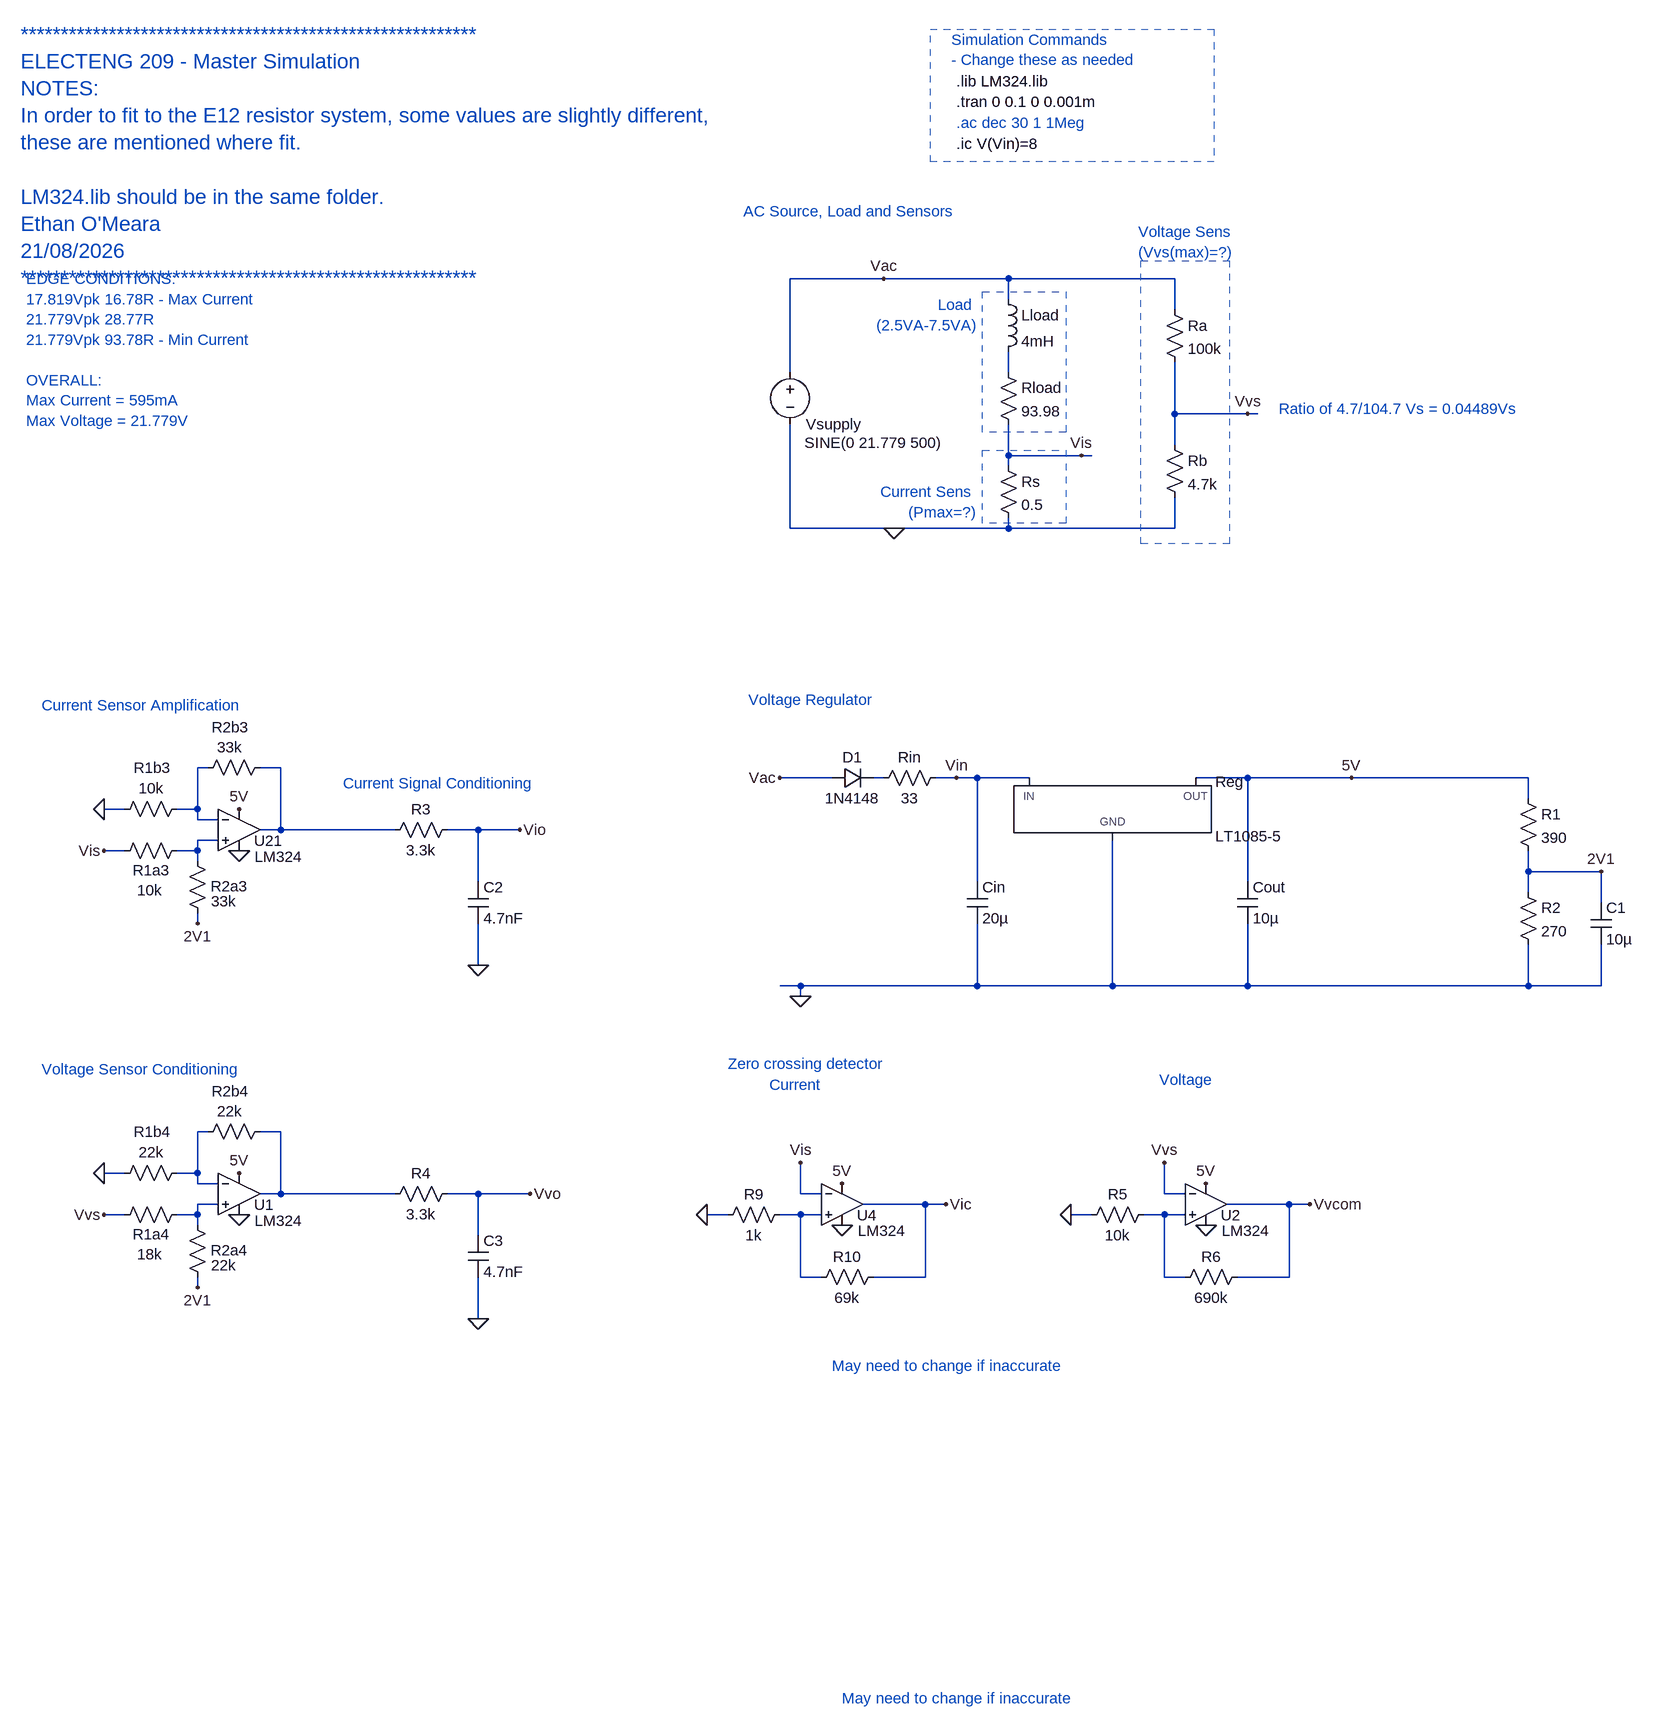
[diagram p0: schematic Master Simulation.asc]
Master Simulation.asc, the LTspice schematic file:
Version 4.1
SHEET 1 1984 2980
WIRE 544 160 400 160
WIRE 736 160 544 160
WIRE 992 160 736 160
WIRE 736 192 736 160
WIRE 992 208 992 160
WIRE 400 304 400 160
WIRE 736 304 736 272
WIRE 992 368 992 288
WIRE 1104 368 992 368
WIRE 1120 368 1104 368
WIRE 992 416 992 368
WIRE 736 432 736 384
WIRE 848 432 736 432
WIRE 864 432 848 432
WIRE 736 448 736 432
WIRE 400 544 400 384
WIRE 560 544 400 544
WIRE 736 544 736 528
WIRE 736 544 560 544
WIRE 992 544 992 496
WIRE 992 544 736 544
WIRE -496 912 -512 912
WIRE -384 912 -416 912
WIRE 464 928 384 928
WIRE 544 928 528 928
WIRE 656 928 624 928
WIRE 688 928 656 928
WIRE 768 928 688 928
WIRE 1104 928 1024 928
WIRE 1264 928 1104 928
WIRE 1536 928 1264 928
WIRE 1536 960 1536 928
WIRE -624 976 -656 976
WIRE -512 976 -512 912
WIRE -512 976 -544 976
WIRE -512 992 -512 976
WIRE -480 992 -512 992
WIRE -384 1008 -384 912
WIRE -384 1008 -416 1008
WIRE -208 1008 -384 1008
WIRE -80 1008 -128 1008
WIRE -16 1008 -80 1008
WIRE -480 1024 -512 1024
WIRE -624 1040 -656 1040
WIRE -512 1040 -512 1024
WIRE -512 1040 -544 1040
WIRE -512 1056 -512 1040
WIRE 1536 1072 1536 1040
WIRE 1648 1072 1536 1072
WIRE -80 1088 -80 1008
WIRE 688 1088 688 928
WIRE 1104 1088 1104 928
WIRE 1536 1104 1536 1072
WIRE 1648 1120 1648 1072
WIRE -512 1152 -512 1136
WIRE -80 1216 -80 1152
WIRE 416 1248 384 1248
WIRE 688 1248 688 1152
WIRE 688 1248 416 1248
WIRE 896 1248 896 1024
WIRE 896 1248 688 1248
WIRE 1104 1248 1104 1152
WIRE 1104 1248 896 1248
WIRE 1536 1248 1536 1184
WIRE 1536 1248 1104 1248
WIRE 1648 1248 1648 1184
WIRE 1648 1248 1536 1248
WIRE 416 1264 416 1248
WIRE -496 1472 -512 1472
WIRE -384 1472 -416 1472
WIRE -624 1536 -656 1536
WIRE -512 1536 -512 1472
WIRE -512 1536 -544 1536
WIRE -512 1552 -512 1536
WIRE -480 1552 -512 1552
WIRE -384 1568 -384 1472
WIRE -384 1568 -416 1568
WIRE -208 1568 -384 1568
WIRE -80 1568 -128 1568
WIRE 0 1568 -80 1568
WIRE 416 1568 416 1520
WIRE 448 1568 416 1568
WIRE 976 1568 976 1520
WIRE 1008 1568 976 1568
WIRE -480 1584 -512 1584
WIRE 608 1584 512 1584
WIRE 640 1584 608 1584
WIRE 1168 1584 1072 1584
WIRE 1200 1584 1168 1584
WIRE -624 1600 -656 1600
WIRE -512 1600 -512 1584
WIRE -512 1600 -544 1600
WIRE 304 1600 272 1600
WIRE 416 1600 384 1600
WIRE 448 1600 416 1600
WIRE 864 1600 832 1600
WIRE 976 1600 944 1600
WIRE 1008 1600 976 1600
WIRE -512 1616 -512 1600
WIRE -80 1632 -80 1568
WIRE 416 1696 416 1600
WIRE 448 1696 416 1696
WIRE 608 1696 608 1584
WIRE 608 1696 528 1696
WIRE 976 1696 976 1600
WIRE 1008 1696 976 1696
WIRE 1168 1696 1168 1584
WIRE 1168 1696 1088 1696
WIRE -512 1712 -512 1696
WIRE -80 1760 -80 1696
FLAG 560 544 0
FLAG 544 160 Vac
FLAG 416 1264 0
FLAG 848 432 Vis
FLAG 1104 368 Vvs
FLAG -448 1040 0
FLAG -448 976 5V
FLAG -656 1040 Vis
FLAG -656 976 0
FLAG -512 1152 2V1
FLAG -448 1600 0
FLAG -448 1536 5V
FLAG -656 1600 Vvs
FLAG -656 1536 0
FLAG -512 1712 2V1
FLAG 384 928 Vac
FLAG 1264 928 5V
FLAG 656 928 Vin
FLAG 1648 1072 2V1
FLAG -80 1216 0
FLAG -16 1008 Vio
FLAG -80 1760 0
FLAG 0 1568 Vvo
FLAG 480 1552 5V
FLAG 480 1616 0
FLAG 416 1520 Vis
FLAG 272 1600 0
FLAG 640 1584 Vic
FLAG 1040 1552 5V
FLAG 1040 1616 0
FLAG 976 1520 Vvs
FLAG 832 1600 0
FLAG 1200 1584 Vvcom
SYMBOL voltage 400 288 R0
WINDOW 0 24 96 Left 2
WINDOW 3 22 124 Left 2
WINDOW 123 0 0 Left 0
WINDOW 39 0 0 Left 0
SYMATTR InstName Vsupply
SYMATTR Value SINE(0 21.779 500)
SYMBOL PowerProducts/LT1085-5 896 928 R0
SYMATTR InstName Reg
SYMBOL res 640 912 R90
WINDOW 0 0 56 VBottom 2
WINDOW 3 32 56 VTop 2
SYMATTR InstName Rin
SYMATTR Value 33
SYMBOL diode 464 944 R270
WINDOW 0 32 32 VTop 2
WINDOW 3 0 32 VBottom 2
SYMATTR InstName D1
SYMATTR Value 1N4148
SYMBOL cap 672 1088 R0
SYMATTR InstName Cin
SYMATTR Value 20µ
SYMATTR SpiceLine Rser=0.001
SYMBOL cap 1088 1088 R0
SYMATTR InstName Cout
SYMATTR Value 10µ
SYMATTR SpiceLine Rser=0.001
SYMBOL res 720 288 R0
SYMATTR InstName Rload
SYMATTR Value 93.98
SYMBOL ind 720 176 R0
SYMATTR InstName Lload
SYMATTR Value 4mH
SYMBOL res 720 432 R0
SYMATTR InstName Rs
SYMATTR Value 0.5
SYMBOL res 976 192 R0
SYMATTR InstName Ra
SYMATTR Value 100k
SYMBOL res 976 400 R0
SYMATTR InstName Rb
SYMATTR Value 4.7k
SYMBOL Opamps/opamp2 -448 944 R0
WINDOW 0 23 81 Left 2
WINDOW 3 24 105 Left 2
SYMATTR InstName U21
SYMATTR Value LM324
SYMBOL res -528 1024 R90
WINDOW 0 62 55 VBottom 2
WINDOW 3 61 57 VTop 2
SYMATTR InstName R1a3
SYMATTR Value 10k
SYMBOL res -528 960 R90
WINDOW 0 -32 53 VBottom 2
WINDOW 3 -32 55 VTop 2
SYMATTR InstName R1b3
SYMATTR Value 10k
SYMBOL res -400 896 R90
WINDOW 0 -30 61 VBottom 2
WINDOW 3 -31 62 VTop 2
SYMATTR InstName R2b3
SYMATTR Value 33k
SYMBOL res -496 1152 R180
WINDOW 0 -62 57 Left 2
WINDOW 3 -44 34 Left 2
SYMATTR InstName R2a3
SYMATTR Value 33k
SYMBOL Opamps/opamp2 -448 1504 R0
WINDOW 0 23 81 Left 2
WINDOW 3 24 105 Left 2
SYMATTR InstName U1
SYMATTR Value LM324
SYMBOL res -528 1584 R90
WINDOW 0 62 55 VBottom 2
WINDOW 3 61 57 VTop 2
SYMATTR InstName R1a4
SYMATTR Value 18k
SYMBOL res -528 1520 R90
WINDOW 0 -32 53 VBottom 2
WINDOW 3 -32 55 VTop 2
SYMATTR InstName R1b4
SYMATTR Value 22k
SYMBOL res -400 1456 R90
WINDOW 0 -30 61 VBottom 2
WINDOW 3 -31 62 VTop 2
SYMATTR InstName R2b4
SYMATTR Value 22k
SYMBOL res -496 1712 R180
WINDOW 0 -62 57 Left 2
WINDOW 3 -44 34 Left 2
SYMATTR InstName R2a4
SYMATTR Value 22k
SYMBOL res 1520 944 R0
SYMATTR InstName R1
SYMATTR Value 390
SYMBOL res 1520 1088 R0
SYMATTR InstName R2
SYMATTR Value 270
SYMBOL cap 1632 1120 R0
SYMATTR InstName C1
SYMATTR Value 10µ
SYMBOL res -112 992 R90
WINDOW 0 0 56 VBottom 2
WINDOW 3 32 56 VTop 2
SYMATTR InstName R3
SYMATTR Value 3.3k
SYMBOL cap -96 1088 R0
SYMATTR InstName C2
SYMATTR Value 4.7nF
SYMBOL res -112 1552 R90
WINDOW 0 0 56 VBottom 2
WINDOW 3 32 56 VTop 2
SYMATTR InstName R4
SYMATTR Value 3.3k
SYMBOL cap -96 1632 R0
SYMATTR InstName C3
SYMATTR Value 4.7nF
SYMBOL Opamps/opamp2 480 1520 R0
WINDOW 0 23 81 Left 2
WINDOW 3 24 105 Left 2
SYMATTR InstName U4
SYMATTR Value LM324
SYMBOL res 400 1584 R90
WINDOW 0 0 56 VBottom 2
WINDOW 3 32 56 VTop 2
SYMATTR InstName R9
SYMATTR Value 1k
SYMBOL res 544 1680 R90
WINDOW 0 0 56 VBottom 2
WINDOW 3 32 56 VTop 2
SYMATTR InstName R10
SYMATTR Value 69k
SYMBOL Opamps/opamp2 1040 1520 R0
WINDOW 0 23 81 Left 2
WINDOW 3 24 105 Left 2
SYMATTR InstName U2
SYMATTR Value LM324
SYMBOL res 960 1584 R90
WINDOW 0 0 56 VBottom 2
WINDOW 3 32 56 VTop 2
SYMATTR InstName R5
SYMATTR Value 10k
SYMBOL res 1104 1680 R90
WINDOW 0 0 56 VBottom 2
WINDOW 3 32 56 VTop 2
SYMATTR InstName R6
SYMATTR Value 690k
TEXT 656 -80 Left 2 ;.ac dec 30 1 1Meg
TEXT 656 -144 Left 2 !.lib LM324.lib
TEXT -784 -216 Left 3 ;*********************************************************\nELECTENG 209 - Master Simulation\nNOTES:\nIn order to fit to the E12 resistor system, some values are slightly different,\nthese are mentioned where fit.\n \nLM324.lib should be in the same folder.\nEthan O'Meara\n21/08/2026\n*********************************************************
TEXT 328 56 Left 2 ;AC Source, Load and Sensors
TEXT 688 200 Right 2 ;Load \n(2.5VA-7.5VA)
TEXT 688 488 Right 2 ;Current Sens \n(Pmax=?)
TEXT 936 88 Left 2 ;Voltage Sens\n(Vvs(max)=?)
TEXT 648 -208 Left 2 ;Simulation Commands\n- Change these as needed
TEXT -752 816 Left 2 ;Current Sensor Amplification
TEXT -752 1376 Left 2 ;Voltage Sensor Conditioning
TEXT 336 808 Left 2 ;Voltage Regulator
TEXT 656 -112 Left 2 !.tran 0 0.1 0 0.001m
TEXT 656 -48 Left 2 !.ic V(Vin)=8
TEXT -288 936 Left 2 ;Current Signal Conditioning
TEXT 304 1368 Left 2 ;Zero crossing detector
TEXT 368 1400 Left 2 ;Current
TEXT 968 1392 Left 2 ;Voltage
TEXT 464 1832 Left 2 ;May need to change if inaccurate
TEXT 1152 360 Left 2 ;Ratio of 4.7/104.7 Vs = 0.04489Vs
TEXT 480 2344 Left 2 ;May need to change if inaccurate
TEXT -776 160 Left 2 ;EDGE CONDITIONS:\n17.819Vpk 16.78R - Max Current\n21.779Vpk 28.77R\n21.779Vpk 93.78R - Min Current\n \nOVERALL:\nMax Current = 595mA\nMax Voltage = 21.779V
RECTANGLE Normal 696 180 824 396 2
RECTANGLE Normal 696 424 824 536 2
RECTANGLE Normal 940 132 1076 568 2
RECTANGLE Normal 616 -224 1052 -20 2

The netlist it stands for:
* Master Simulation.asc
Vsupply Vac 0 SINE(0 21.779 500)
X§Reg 0 5V Vin LT1085-5  ; pins GND OUT IN
Rin Vin N004 33
D1 Vac N004 1N4148
Cin Vin 0 20µ Rser=0.001
Cout 5V 0 10µ Rser=0.001
Rload N001 Vis 93.98
Lload Vac N001 4mH
Rs Vis 0 0.5
Ra Vac Vvs 100k
Rb Vvs 0 4.7k
X§U21 N005 N002 5V 0 N003 LM324  ; pins In+ In- V+ V- OUT
R1a3 N005 Vis 10k
R1b3 N002 0 10k
R2b3 N003 N002 33k
R2a3 2V1 N005 33k
X§U1 N008 N006 5V 0 N007 LM324  ; pins In+ In- V+ V- OUT
R1a4 N008 Vvs 18k
R1b4 N006 0 22k
R2b4 N007 N006 22k
R2a4 2V1 N008 22k
R1 5V 2V1 390
R2 2V1 0 270
C1 2V1 0 10µ
R3 Vio N003 3.3k
C2 Vio 0 4.7nF
R4 Vvo N007 3.3k
C3 Vvo 0 4.7nF
X§U4 N009 Vis 5V 0 Vic LM324  ; pins In+ In- V+ V- OUT
R9 N009 0 1k
R10 Vic N009 69k
X§U2 N010 Vvs 5V 0 Vvcom LM324  ; pins In+ In- V+ V- OUT
R5 N010 0 10k
R6 Vvcom N010 690k
.model D D
.lib standard.dio
* .ac dec 30 1 1Meg
.lib LM324.lib
* *********************************************************
* ELECTENG 209 - Master Simulation
* NOTES:
* In order to fit to the E12 resistor system, some values are slightly different,
* these are mentioned where fit.
* LM324.lib should be in the same folder.
* Ethan O'Meara
* 21/08/2026
* *********************************************************
* AC Source, Load and Sensors
* Load
* (2.5VA-7.5VA)
* Current Sens
* (Pmax=?)
* Voltage Sens
* (Vvs(max)=?)
* Simulation Commands
* - Change these as needed
* Current Sensor Amplification
* Voltage Sensor Conditioning
* Voltage Regulator
.tran 0 0.1 0 0.001m
.ic V(Vin)=8
* Current Signal Conditioning
* Zero crossing detector
* Current
* Voltage
* May need to change if inaccurate
* Ratio of 4.7/104.7 Vs = 0.04489Vs
* May need to change if inaccurate
* EDGE CONDITIONS:
* 17.819Vpk 16.78R - Max Current
* 21.779Vpk 28.77R
* 21.779Vpk 93.78R - Min Current
* OVERALL:
* Max Current = 595mA
* Max Voltage = 21.779V
.backanno
.end